# Altium schematic sheet SCHMITT_LED.SchDoc
size A4
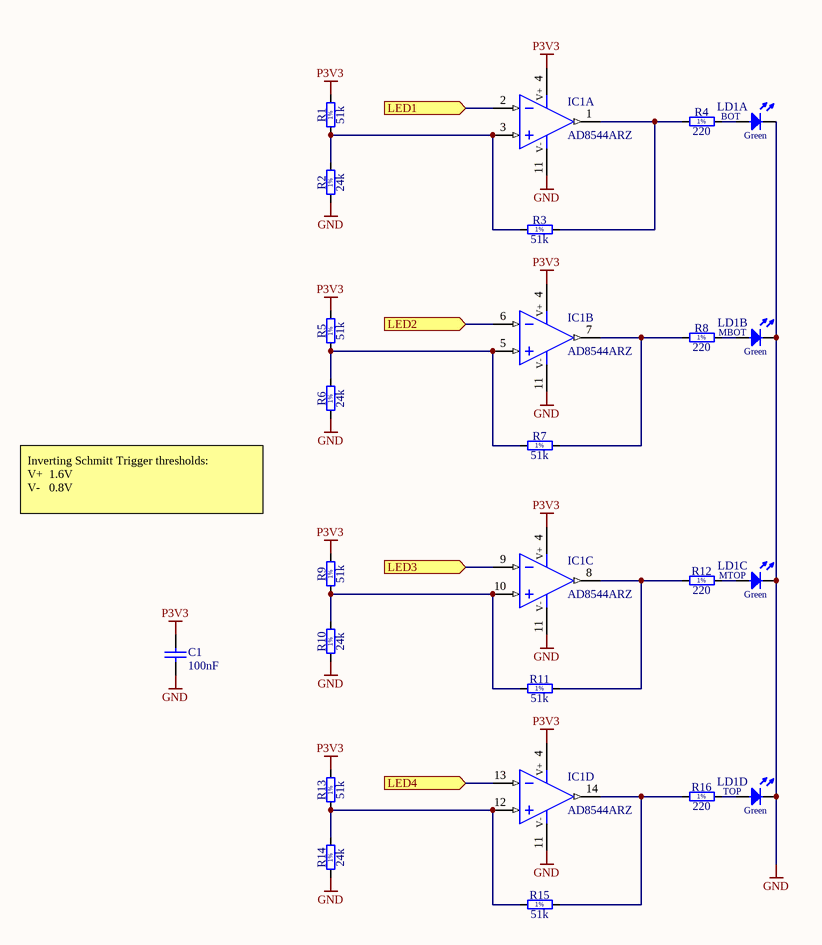
[diagram p0: SCHMITT_LED.SchDoc]

## Parts
C1  100nF  [C0402C104K4RACTU]
IC1  AD8544ARZ  [SOIC127P600X175-14N]  (parts A,B,C,D of 4)
LD1  Green  [LED_BIVAR_H485CGDL]  (value not drawn)  (parts A,B,C,D of 4)
R1  51k  [RESC1608X55N]
R2  24k  [RESC1608X55N]
R3  51k  [RESC1608X55N]
R4  220  [RESC1608X55N]
R5  51k  [RESC1608X55N]
R6  24k  [RESC1608X55N]
R7  51k  [RESC1608X55N]
R8  220  [RESC1608X55N]
R9  51k  [RESC1608X55N]
R10  24k  [RESC1608X55N]
R11  51k  [RESC1608X55N]
R12  220  [RESC1608X55N]
R13  51k  [RESC1608X55N]
R14  24k  [RESC1608X55N]
R15  51k  [RESC1608X55N]
R16  220  [RESC1608X55N]

## Ports
LED1 (in), LED2 (in), LED3 (in), LED4 (in)

## Nets
GND: C1.1 IC1.11(V-) LD1.1(C) LD1.3(C) LD1.5(C) LD1.7(C) R2.1 R6.1 R10.1 R14.1
P3V3: C1.2 IC1.4(V+) R1.2 R5.2 R9.2 R13.2
LED1: IC1.2(IN-) ; port LED1
LED2: IC1.6(IN-) ; port LED2
LED3: IC1.9(IN-) ; port LED3
LED4: IC1.13(IN-) ; port LED4
NetIC1_1: IC1.1(OUT) R3.2 R4.1
NetIC1_3: IC1.3(IN+) R1.1 R2.2 R3.1
NetIC1_5: IC1.5(IN+) R5.1 R6.2 R7.1
NetIC1_7: IC1.7(OUT) R7.2 R8.1
NetIC1_8: IC1.8(OUT) R11.2 R12.1
NetIC1_10: IC1.10(IN+) R9.1 R10.2 R11.1
NetIC1_12: IC1.12(IN+) R13.1 R14.2 R15.1
NetIC1_14: IC1.14(OUT) R15.2 R16.1
NetLD1_2: LD1.2(A) R4.2
NetLD1_4: LD1.4(A) R8.2
NetLD1_6: LD1.6(A) R12.2
NetLD1_8: LD1.8(A) R16.2

## Notes on the sheet
- Inverting Schmitt Trigger thresholds:
  V+  1.6V
  V-   0.8V
- (in symbol LED_BIVAR_H485CGDL, part A) BOT
- (in symbol LED_BIVAR_H485CGDL, part B) MBOT
- (in symbol LED_BIVAR_H485CGDL, part C) MTOP
- (in symbol LED_BIVAR_H485CGDL, part D) TOP
- (in symbol R0603_24K_1%_0.1W_100PPM) 1%
- (in symbol R0603_51K_1%_0.1W_100PPM) 1%
- (in symbol R0603_220R_1%_0.1W_100PPM) 1%

## Library data of the parts
C1 = C0402C104K4RACTU: Capacitor; Ceramic; Cap; .100uF; Tol 10%; SMT; Vol-Rtg 16V; X7R; Tape and Reel; Manufacturer 1: KEMET; Dissipation Factor: 3.5%; Supplier 1: Digi-Key; Manufacturer Part Number 1: C0402C104K4RACTU; Stock 1: 636137; Pricing 1: 1=0,10000, 10=0,04000, 50=0,02180, 100=0,01780, 500=0,01270, 1000=0,00998, 2500=0,00908, 5000=0,00835 (USD); RoHS: Yes; Mount: Surface Mount; Case/Package: 0402; Case Code (Imperial): 0402; Case Code (Metric): 1005; Contact Plating: Tin,Matte; Min Operating Temperature: -55°C; Max Operating Temperature: 125°C; Capacitance: 100nF; Tolerance: 10%; Packaging: Tape and Reel; Voltage Rating (DC): 16V; Dielectric: X7R; Package Quantity: 10000; Voltage Rating: 16V; Termination: SMD/SMT; Length: 1mm; Height: 0.5mm; Width: 0.5mm; Depth: 0.5mm; Radiation Hardening: No; ComponentLink1URL: https://datasheet.ciiva.com/45846/docfinderpartnumberc0402c102k5ractu-45846919.pdf?src-supplier=Onlinecomponents.com; ComponentLink1Description: https://datasheet.ciiva.com/45846/docfinderpartnumberc0402c102k5ractu-45846919.pdf?src-supplier=Onlinecomponents.com; ComponentLink2URL: https://datasheet.ciiva.com/18192/getdatasheetpartid-385384-18192412.pdf?src-supplier=Verical; ComponentLink2Description: https://datasheet.ciiva.com/18192/getdatasheetpartid-385384-18192412.pdf?src-supplier=Verical; Supplier Part Number 1: 399-3521-1-ND
IC1 = AD8544ARZ: Quad Operational Amplifier; Part Description: Quad CMOS Rail-to-Rail General-Purpose Amplifiers; Manufacturer: ANALOG DEVICES; PressFit: No; Bonding: No; Part Number: AD8544ARZ; Component Kind: Standard; Component Type: Standard; Device: AD8544ARZ; PackageDescription: SOIC 14, Pitch 1.27mm - Body 4x8.75mm, IPC Medium Density; Manufacturer Part Number: AD8544ARZ; Pin Count: 14; Case: SOIC14; Mounted: Yes; Socket: No; SMD: Yes; Sense: No; ComponentHeight: 1.75mm; Author: CERN DEM JLC; HelpURL: \\cern.ch\dfs\Applications\Altium\Datasheets\AD8544ARZ.pdf; CreateDate: 02.05.2012; LatestRevisionDate: 02.05.2012
LD1 = LED_BIVAR_H485CGDL: LED x4 Green 1C2A-BOT_3C4A_5C6A_7C8A-TOP; Part Description: Quad-Level 2mm Green LED, PCB Edge Mounting; Manufacturer: BIVAR; PressFit: No; Bonding: No; Part Number: LED_BIVAR_H485CGDL; Component Kind: Standard; Component Type: Standard; Color: Green; PackageDescription: Quad-Level 2mm Green, PCB Edge Mounting  BIVAR H485CHDL; Manufacturer Part Number: H485CGDL; Pin Count: 8; Mounted: Yes; Socket: No; SMD: No; Sense: No; ComponentHeight: 11.3mm; HelpURL: \\cern.ch\dfs\Applications\Altium\Datasheets\LED_BIVAR_H485CGDL.pdf; Author: CERN DEM JLC; CreateDate: 04.06.2012; LatestRevisionDate: 04.06.2012
R1 R3 R5 R7 R9 R11 R13 R15 = R0603_51K_1%_0.1W_100PPM: Resistor - 1%; Part Description: General Purpose Thick Film Chip Resistor; Manufacturer: GENERIC; Manufacturer1 Part Number: NRC06F5102TRF; Power: 0.1W; TC: ±100ppm/°C; PressFit: No; Part Number: R0603_51K_1%_0.1W_100PPM; Component Kind: Standard; Component Type: Standard; Pin Count: 2; Value: 51k; Status: Preferred; Tolerance: ±1%; Manufacturer Part Number: R0603_51K_1%_0.1W_100PPM; Case: 0603; Mounted: Yes; Sense: No; Socket: No; SMD: Yes; Manufacturer1 Example: NIC COMPONENT; Manufacturer1 ComponentHeight: 0.55mm; HelpURL: \\cern.ch\dfs\Applications\Altium\Datasheets\R0603_NIC_NRC.pdf; Author: CERN DEM JLC; CreateDate: 03.12.2007; LatestRevisionDate: 13.03.2008
R2 R6 R10 R14 = R0603_24K_1%_0.1W_100PPM: Resistor - 1%; Part Description: General Purpose Thick Film Chip Resistor; Manufacturer: GENERIC; Manufacturer1 Part Number: NRC06F2402TRF; Power: 0.1W; TC: ±100ppm/°C; PressFit: No; Part Number: R0603_24K_1%_0.1W_100PPM; Component Kind: Standard; Component Type: Standard; Pin Count: 2; Value: 24k; Status: Preferred; Tolerance: ±1%; Manufacturer Part Number: R0603_24K_1%_0.1W_100PPM; Case: 0603; Mounted: Yes; Sense: No; Socket: No; SMD: Yes; Manufacturer1 Example: NIC COMPONENT; Manufacturer1 ComponentHeight: 0.55mm; HelpURL: \\cern.ch\dfs\Applications\Altium\Datasheets\R0603_NIC_NRC.pdf; Author: CERN DEM JLC; CreateDate: 03.12.2007; LatestRevisionDate: 13.03.2008
R4 R8 R12 R16 = R0603_220R_1%_0.1W_100PPM: Resistor - 1%; Part Description: General Purpose Thick Film Chip Resistor; Manufacturer: GENERIC; Manufacturer1 Part Number: NRC06F2200TRF; Power: 0.1W; TC: ±100ppm/°C; PressFit: No; Part Number: R0603_220R_1%_0.1W_100PPM; Component Kind: Standard; Component Type: Standard; Pin Count: 2; Value: 220; Status: Preferred; Tolerance: ±1%; Manufacturer Part Number: R0603_220R_1%_0.1W_100PPM; Case: 0603; Mounted: Yes; Sense: No; Socket: No; SMD: Yes; Manufacturer1 Example: NIC COMPONENT; Manufacturer1 ComponentHeight: 0.55mm; HelpURL: \\cern.ch\dfs\Applications\Altium\Datasheets\R0603_NIC_NRC.pdf; Author: CERN DEM JLC; CreateDate: 03.12.2007; LatestRevisionDate: 13.03.2008